# Altium schematic sheet adapter.SchDoc
size 136 x 70 mm
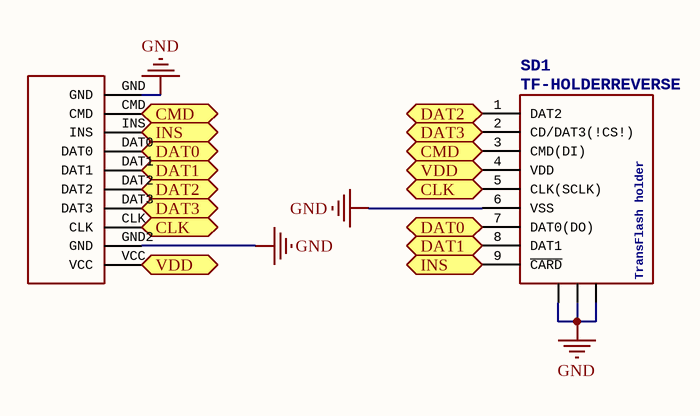
[diagram p0: adapter.SchDoc]

## Parts
SD1  TF-HOLDERREVERSE  TransFlashholder: TransFlash holder  [TF-PULL-REVERSE]
U$1  CONNECTOR  [CONNECTOR]  (value not drawn)

## Ports
CLK, CMD, DAT0, DAT1, DAT2, DAT3, INS, VDD

## Nets
GND: SD1.6(VSS) SD1.S1 SD1.S2 SD1.S3 U$1.GND U$1.GND2(GND)
CLK: SD1.5(CLK(SCLK)) U$1.CLK ; port CLK
CMD: SD1.3(CMD(DI)) U$1.CMD ; port CMD
DAT0: SD1.7(DAT0(DO)) U$1.DAT0 ; port DAT0
DAT1: SD1.8(DAT1) U$1.DAT1 ; port DAT1
DAT2: SD1.1(DAT2) U$1.DAT2 ; port DAT2
DAT3: SD1.2(CD/DAT3(!CS!)) U$1.DAT3 ; port DAT3
INS: SD1.9(~{CARD}) U$1.INS ; port INS
VDD: SD1.4(VDD) U$1.VCC ; port VDD

## Library data of the parts
SD1 = TF-HOLDERREVERSE: TF / Micro SD socket is PUSH-PUSH type, the card can be pushed into and auto locked and pushed out by simply press the card.    Surface Mounting type.